# EAGLE design miniMother_v1 (EAGLE 9.6.2)
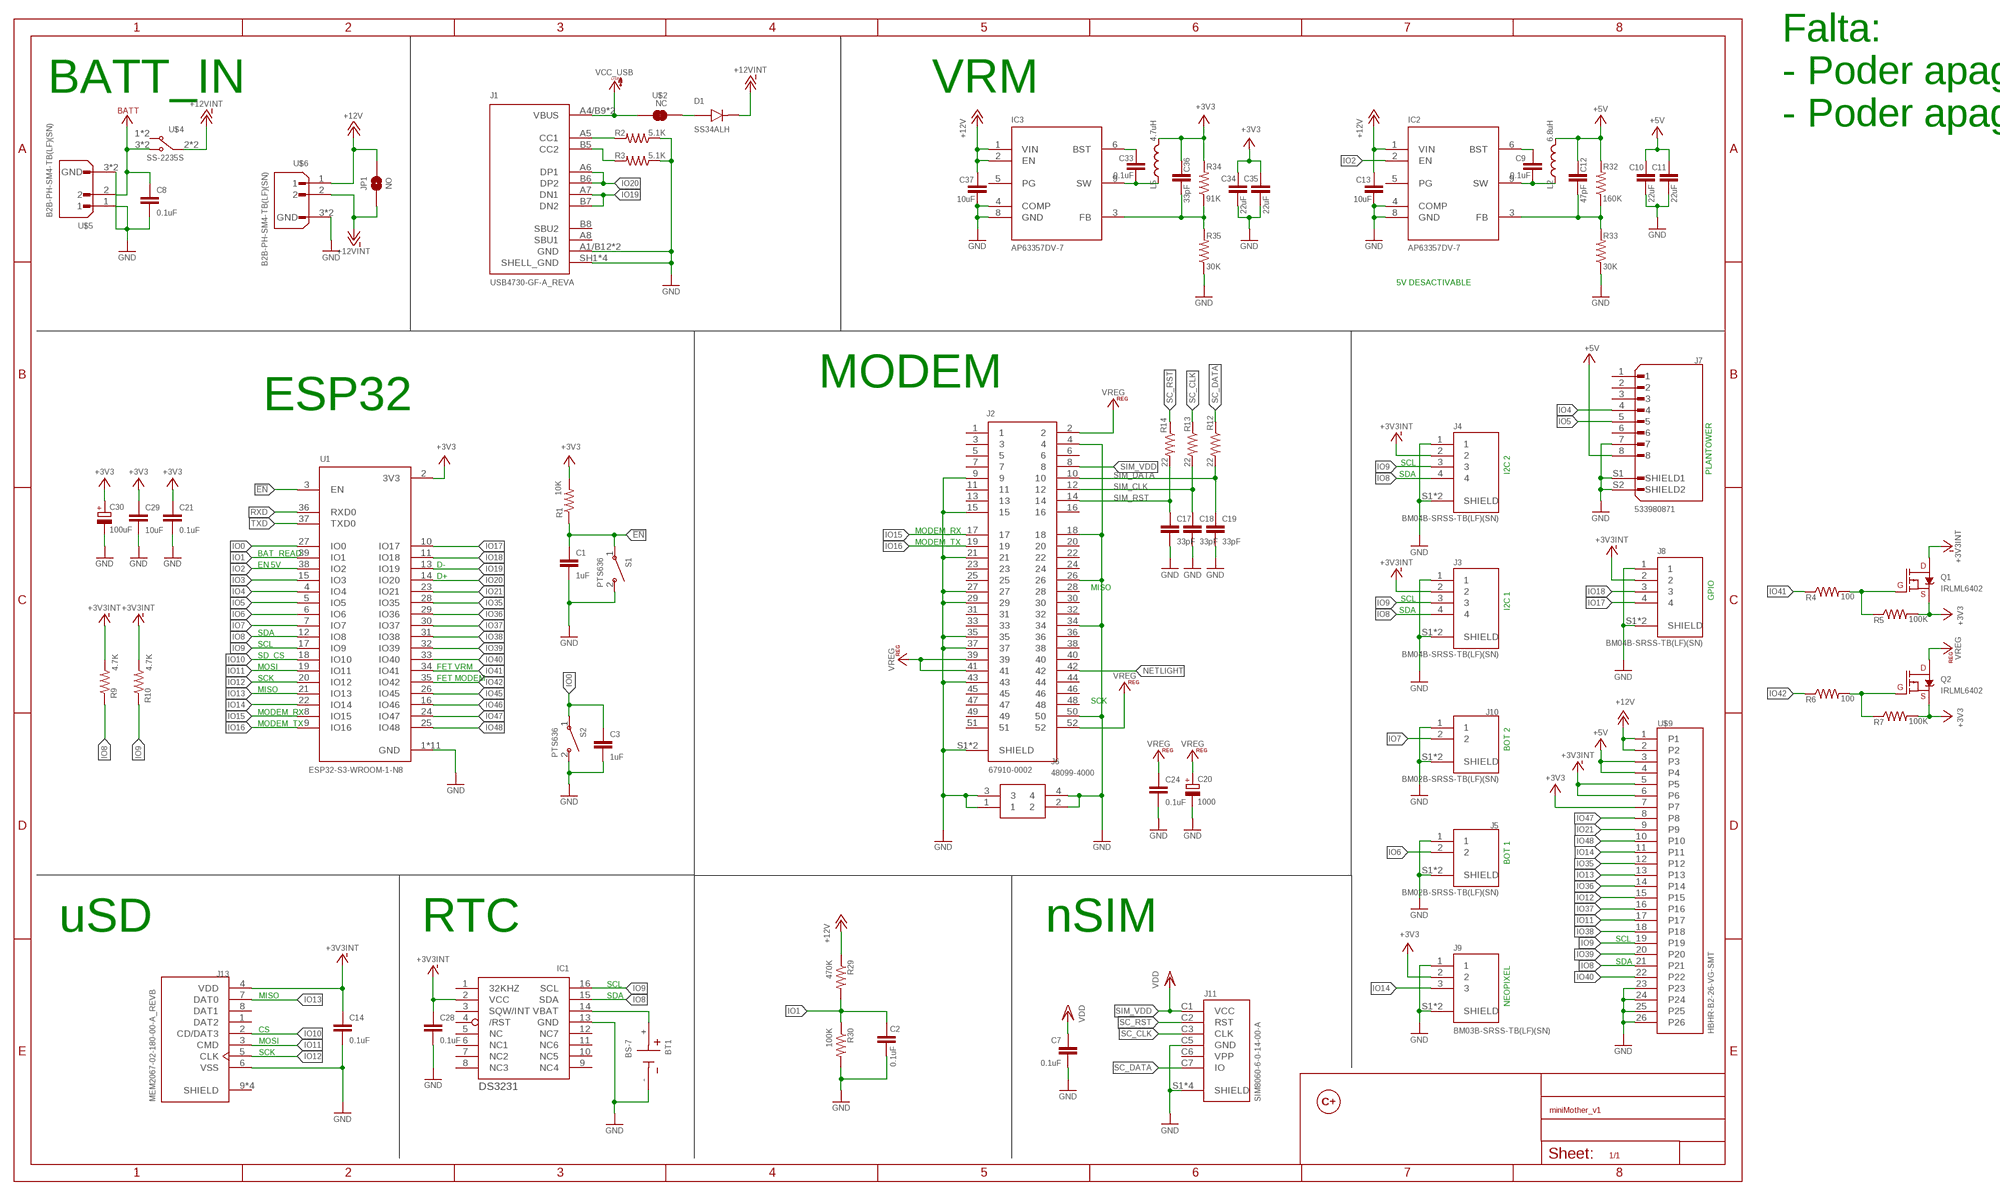
[diagram p0: schematic, sheet 1, part 1 of 2]
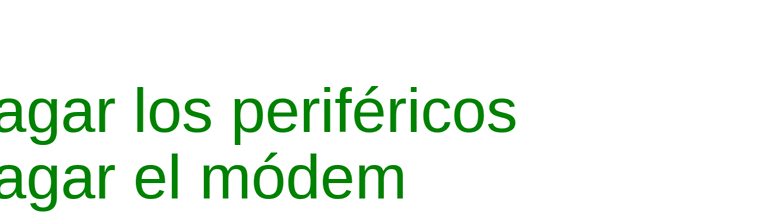
[diagram p1: schematic, sheet 1, part 2 of 2]

## Parts
BT1  BS-7  [BAT_BS-7]
C1  1uF  C-EUC0805  [C0805]
C2  0.1uF  C-EUC0805  [C0805]
C3  1uF  C-EUC0805  [C0805]
C7  0.1uF  C-EUC0805  [C0805]
C8  0.1uF  C-EUC0805  [C0805]
C9  0.1uF  C-EUC0805  [C0805]
C10  22uF  C-EUC0805  [C0805]
C11  22uF  C-EUC0805  [C0805]
C12  47pF  C-EUC0805  [C0805]
C13  10uF  C-EUC0805  [C0805]
C14  0.1uF  C-EUC0805  [C0805]
C17  33pF  C-EUC0805  [C0805]
C18  33pF  C-EUC0805  [C0805]
C19  33pF  C-EUC0805  [C0805]
C20  1000  CPOL-EUSMCD  [SMC_D]
C21  0.1uF  C-EUC0805  [C0805]
C24  0.1uF  C-EUC0805  [C0805]
C28  0.1uF  C-EUC0805  [C0805]
C29  10uF  C-EUC0805  [C0805]
C30  100uF  CPOL-EUCT3528  [CT3528]
C33  0.1uF  C-EUC0805  [C0805]
C34  22uF  C-EUC0805  [C0805]
C35  22uF  C-EUC0805  [C0805]
C36  33pF  C-EUC0805  [C0805]
C37  10uF  C-EUC0805  [C0805]
D1  SS34ALH  [SODFL5226X100N]
IC1  DS3231/SO  [SO16W]
IC2  AP63357DV-7  [AP63357DV7]
IC3  AP63357DV-7  [AP63357DV7]
J1  USB4730-GF-A_REVA  [GCT_USB4730-GF-A_REVA]
J2  67910-0002  [MOLEX_67910-0002]
J3  BM04B-SRSS-TB(LF)(SN)  [JST_BM04B-SRSS-TB(LF)(SN)]
J4  BM04B-SRSS-TB(LF)(SN)  [JST_BM04B-SRSS-TB(LF)(SN)]
J5  BM02B-SRSS-TB(LF)(SN)  [JST_BM02B-SRSS-TB(LF)(SN)]
J6  48099-4000  [480994000]
J7  533980871  [MOLEX_533980871]
J8  BM04B-SRSS-TB(LF)(SN)  [JST_BM04B-SRSS-TB(LF)(SN)]
J9  BM03B-SRSS-TB(LF)(SN)  [JST_BM03B-SRSS-TB(LF)(SN)]
J10  BM02B-SRSS-TB(LF)(SN)  [JST_BM02B-SRSS-TB(LF)(SN)]
J11  SIM8060-6-0-14-00-A  [GCT_SIM8060-6-0-14-00-A]
J13  MEM2067-02-180-00-A_REVB  [GCT_MEM2067-02-180-00-A_REVB]
JP1  NO  JUMPER-SMT_2_NO_NO-SILK_ROUND  [SMT-JUMPER_2_NO_NO-SILK_ROUND]
L2  6.8uH  MDH7045C-220MA=P3  [IND_MDH7045C-220MA=P3]
L5  4.7uH  MDH7045C-220MA=P3  [IND_MDH7045C-220MA=P3]
Q1  IRLML6402  MOSFET_PCH-SI2309DS  [SOT23-3]
Q2  IRLML6402  MOSFET_PCH-SI2309DS  [SOT23-3]
R1  10K  R-US_R0805  [R0805]
R2  5.1K  R-US_R0805  [R0805]
R3  5.1K  R-US_R0805  [R0805]
R4  100  R-US_R0805  [R0805]
R5  100K  R-US_R0805  [R0805]
R6  100  R-US_R0805  [R0805]
R7  100K  R-US_R0805  [R0805]
R9  4.7K  R-US_R0805  [R0805]
R10  4.7K  R-US_R0805  [R0805]
R12  22  R-US_R0805  [R0805]
R13  22  R-US_R0805  [R0805]
R14  22  R-US_R0805  [R0805]
R29  470K  R-US_R0805  [R0805]
R30  100K  R-US_R0805  [R0805]
R32  160K  R-US_R0805  [R0805]
R33  30K  R-US_R0805  [R0805]
R34  91K  R-US_R0805  [R0805]
R35  30K  R-US_R0805  [R0805]
S1  PTS636  PTS636_SM43J_SMTR_LFS  [SW_PTS636_SM43J_SMTR_LFS]
S2  PTS636  PTS636_SM43J_SMTR_LFS  [SW_PTS636_SM43J_SMTR_LFS]
U1  ESP32-S3-WROOM-1-N8  [XCVR_ESP32-S3-WROOM-1-N8]
U$1  LOGO_CMAS10MM  [LOGO_10MM]
U$2  NC  SMT-JUMPER-2_NC  [SMT-JUMPER-2_NC]
U$4  SS-2235S  [SS-2235S]
U$5  B2B-PH-SM4-TB(LF)(SN)  [JST_B2B-PH-SM4-TB(LF)(SN)]
U$6  B2B-PH-SM4-TB(LF)(SN)  [JST_B2B-PH-SM4-TB(LF)(SN)]
U$9  HBHR-B2-26-VG-SMT  [HBHR-B2-26-VG-SMT]

## Nets
!EN: C1.1 R1.1 S1.1(COM) U1.3(EN)
+3V3 [PWR]: C21.1 C29.1 C30.+ C34.1 C35.1 C36.1 J9.2 L5.2 Q1.2(S) Q2.2(S) R1.2 R5.2 R7.2 R34.2 U1.2(3V3) U$9.7
+3V3INT [PWR]: C14.1 C28.1 IC1.2(VCC) J3.2 J4.2 J8.2 J13.4(VDD) Q1.3(D) R9.2 R10.2 U$9.5 U$9.6
+5V [PWR]: C10.1 C11.1 C12.1 J7.8 L2.2 R32.2 U$9.3 U$9.4
+12V [PWR_IN]: C13.1 C37.1 IC2.1(VIN) IC3.1(VIN) IC3.2(EN) JP1.1 R29.1 U$6.1 U$9.1 U$9.2
+12VINT [PWR_IN]: D1.1(K) JP1.2 U$4.2(P1) U$4.5(P1) U$6.2
GND [PWR]: BT1.- C1.2 C2.2 C3.2 C7.2 C8.2 C10.2 C11.2 C13.2 C14.2 C17.2 C18.2 C19.2 C20.- C21.2 C24.2 C28.2 C29.2 C30.- C34.2 C35.2 C37.2 IC1.13(GND) IC2.4(COMP) IC2.8(GND) IC3.4(COMP) IC3.8(GND) J1.A1/B12(GND) J1.B1/A12(GND) J1.SH1(SHELL_GND) J1.SH2(SHELL_GND) J1.SH3(SHELL_GND) J1.SH4(SHELL_GND) J2.4 J2.9 J2.15 J2.18 J2.21 J2.26 J2.27 J2.29 J2.34 J2.35 J2.37 J2.43 J2.50 J2.S1(SHIELD) J2.S2(SHIELD) J3.1 J3.S1(SHIELD) J3.S2(SHIELD) J4.1 J4.S1(SHIELD) J4.S2(SHIELD) J5.1 J5.S1(SHIELD) J5.S2(SHIELD) J6.1 J6.2 J6.3 J6.4 J7.7 J7.S1(SHIELD1) J7.S2(SHIELD2) J8.1 J8.S1(SHIELD) J8.S2(SHIELD) J9.1 J9.S1(SHIELD) J9.S2(SHIELD) J10.1 J10.S1(SHIELD) J10.S2(SHIELD) J11.C5(GND) J11.S1(SHIELD) J11.S2(SHIELD) J11.S3(SHIELD) J11.S4(SHIELD) J13.6(VSS) R2.1 R3.1 R30.2 R33.1 R35.1 S1.2(NO) S2.2(NO) U1.1(GND) U1.40(GND) U1.41_1(GND) U1.41_2(GND) U1.41_3(GND) U1.41_4(GND) U1.41_5(GND) U1.41_6(GND) U1.41_7(GND) U1.41_8(GND) U1.41_9(GND) U$5.1 U$5.3(GND) U$5.4(GND) U$6.3(GND) U$6.4(GND) U$9.23 U$9.24 U$9.25 U$9.26
IO0: C3.1 S2.1(COM) U1.27(IO0)
IO1: C2.1 R29.2 R30.1 U1.39(IO1)
IO2: IC2.2(EN) U1.38(IO2)
IO3: U1.15(IO3)
IO4: J7.4 U1.4(IO4)
IO5: J7.5 U1.5(IO5)
IO6: J5.2 U1.6(IO6)
IO7: J10.2 U1.7(IO7)
IO8: IC1.15(SDA) J3.4 J4.4 R9.1 U1.12(IO8) U$9.21
IO9: IC1.16(SCL) J3.3 J4.3 R10.1 U1.17(IO9) U$9.19
IO10: J13.2(CD/DAT3) U1.18(IO10)
IO11: J13.3(CMD) U1.19(IO11) U$9.17
IO12: J13.5(CLK) U1.20(IO12) U$9.15
IO13: J13.7(DAT0) U1.21(IO13) U$9.13
IO14: J9.3 U1.22(IO14) U$9.11
IO15: J2.17 U1.8(IO15)
IO16: J2.19 U1.9(IO16)
IO17: J8.4 U1.10(IO17)
IO18: J8.3 U1.11(IO18)
IO19: J1.A7(DN1) J1.B7(DN2) U1.13(IO19)
IO20: J1.A6(DP1) J1.B6(DP2) U1.14(IO20)
IO21: U1.23(IO21) U$9.9
IO35: U1.28(IO35) U$9.12
IO36: U1.29(IO36) U$9.14
IO37: U1.30(IO37) U$9.16
IO38: U1.31(IO38) U$9.18
IO39: U1.32(IO39) U$9.20
IO40: U1.33(IO40) U$9.22
IO41: R4.1 U1.34(IO41)
IO42: R6.1 U1.35(IO42)
IO45: U1.26(IO45)
IO46: U1.16(IO46)
IO47: U1.24(IO47) U$9.8
IO48: U1.25(IO48) U$9.10
N$1: J1.A5(CC1) R2.2
N$2: BT1.+ IC1.14(VBAT)
N$3: D1.2(A) U$2.2
N$4: Q1.1(G) R4.2 R5.1
N$5: J1.B5(CC2) R3.2
N$7: Q2.1(G) R6.2 R7.1
N$10: C9.1 IC2.6(BST)
N$26: C9.2 IC2.9(SW) L2.1
N$31: C12.2 IC2.3(FB) R32.1 R33.2
N$33: C33.1 IC3.6(BST)
N$34: C33.2 IC3.9(SW) L5.1
N$35: C36.2 IC3.3(FB) R34.1 R35.2
NETLIGHT: J2.42
RXD: U1.36(RXD0)
SC_CLK: J11.C3(CLK) R13.1
SC_DATA: J11.C7(IO) R12.1
SC_RST: J11.C2(RST) R14.1
SIM_CLK: C18.1 J2.12 R13.2
SIM_DATA: C19.1 J2.10 R12.2
SIM_RST: C17.1 J2.14 R14.2
SIM_VDD: C7.1 J2.8 J11.C1(VCC) ; supply symbol labelled VDD
TXD: U1.37(TXD0)
VBAT [PWR_IN]: C8.1 U$4.3(T2) U$4.6(T2) U$5.2
VCC_USB [PWR]: J1.A4/B9(VBUS) J1.B4/A9(VBUS) U$2.1
VREG [PWR]: C20.+ C24.1 J2.2 J2.39 J2.41 J2.52 Q2.3(D)
Unconnected: IC1.1(32KHZ) IC1.3(SQW/INT) IC1.4(/RST) IC1.5(NC) IC1.6(NC1) IC1.7(NC2) IC1.8(NC3) IC1.9(NC4) IC1.10(NC5) IC1.11(NC6) IC1.12(NC7) IC2.5(PG) IC3.5(PG) J1.A8(SBU1) J1.B8(SBU2) J2.1 J2.3 J2.5 J2.6 J2.7 J2.11 J2.13 J2.16 J2.20 J2.22 J2.23 J2.24 J2.25 J2.28 J2.30 J2.31 J2.32 J2.33 J2.36 J2.38 J2.40 J2.44 J2.45 J2.46 J2.47 J2.48 J2.49 J2.51 J7.1 J7.2 J7.3 J7.6 J11.C6(VPP) J13.1(DAT2) J13.8(DAT1) J13.9(SHIELD) J13.10(SHIELD) J13.11(SHIELD) J13.12(SHIELD) U$4.1(T1) U$4.4(T1)

## Notes on the sheet
- BATT_IN | VRM
- Falta:
  - Poder apagar los periféricos
  - Poder apagar el módem
- 5V DESACTIVABLE
- MODEM
- ESP32
- I2C 2
- SCL
- SDA | PLANTOWER
- MODEM_RX
- MODEM_TX
- BAT_READ
- EN 5V | D-
- D+ | GPIO
- MISO | I2C 1
- SCL
- SDA
- SDA
- SCL
- SD_CS
- MOSI | FET VRM
- SCK | FET MODEM
- MISO
- SCK
- MODEM_RX
- MODEM_TX | BOT 2
- BOT 1
- uSD | RTC | nSIM
- SCL
- NEOPIXEL | SDA
- SCL
- MISO | SDA
- CS
- MOSI
- SCK

## Library data of the parts
BT1 = BS-7:BS-7: BATTERY HOLDER COIN 20MM PC PIN Check availability <https://pricing.snapeda.com/parts/BS-7/MPD%20%28Memory/view-part?ref=eda>; AVAILABILITY: In Stock; CHECK_PRICES: https://www.snapeda.com/parts/BS-7/MPD+%2528Memory+Protection+Devices%2529/view-part/?ref=eda; DESCRIPTION: Battery Holder (Open) Coin, 20.0mm 1 Cell PC Pin; MF: MPD (Memory; MP: BS-7; PACKAGE: None; PRICE: None; PURCHASE-URL: https://www.snapeda.com/api/url_track_click_mouser/?unipart_id=1156502&manufacturer=MPD (Memory&part_name=BS-7&search_term=coin cell 20mm; SNAPEDA_LINK: https://www.snapeda.com/parts/BS-7/MPD+%2528Memory+Protection+Devices%2529/view-part/?ref=snap
C1-C3 C7-C14 C17-C19 C21 C24 C28 C29 C33-C37 = rcl:C-EU: CAPACITOR, European symbol; SPICEPREFIX: C
C20 C30 = rcl:CPOL-EU: POLARIZED CAPACITOR, European symbol; SPICEPREFIX: C
D1 = SS34ALH:SS34ALH: Check availability <https://pricing.snapeda.com/parts/SS34ALH/Taiwan%20Semiconductor/view-part?ref=eda>; AVAILABILITY: In Stock; CHECK_PRICES: https://www.snapeda.com/parts/SS34ALH/Taiwan+Semiconductor/view-part/?ref=eda; DESCRIPTION: 3A, 40V, Schottky Rectifier; MF: Taiwan Semiconductor; MP: SS34ALH; PACKAGE: DO-221AC-2 Taiwan Semiconductor; PRICE: None; PURCHASE-URL: https://www.snapeda.com/api/url_track_click_mouser/?unipart_id=9409378&manufacturer=Taiwan Semiconductor&part_name=SS34ALH&search_term=ss34; SNAPEDA_LINK: https://www.snapeda.com/parts/SS34ALH/Taiwan+Semiconductor/view-part/?ref=snap
IC1 = DS3231:DS3231: Check availability <https://pricing.snapeda.com/parts/DS3231/Analog%20Devices/view-part?ref=eda>; AVAILABILITY: In Stock; CHECK_PRICES: https://www.snapeda.com/parts/DS3231/Analog+Devices/view-part/?ref=eda; DESCRIPTION: Real Time Clock (RTC) IC Clock/Calendar - I²C, 2-Wire Serial 8-SOIC (0.154, 3.90mm Width); MF: Analog Devices; MP: DS3231; PACKAGE: SOIC-16 Maxim Integrated; PRICE: None; SNAPEDA_LINK: https://www.snapeda.com/parts/DS3231/Analog+Devices/view-part/?ref=snap
IC2 IC3 = AP63357DV-7:AP63357DV-7: Switching Voltage Regulators DCDC Conv HV Buck V-DFN3020-13 T&R 3K Source: Datasheet <https://www.diodes.com//assets/Datasheets/AP63356-AP63357.pdf>; ARROW_PART_NUMBER: AP63357DV-7; ARROW_PRICE-STOCK: https://www.arrow.com/en/products/ap63357dv-7/diodes-incorporated?utm_currency=USD&region=europe; DESCRIPTION: Switching Voltage Regulators DCDC Conv HV Buck V-DFN3020-13 T&R 3K; HEIGHT: 0.85mm; MANUFACTURER_NAME: Diodes Incorporated; MANUFACTURER_PART_NUMBER: AP63357DV-7; MOUSER_PART_NUMBER: 621-AP63357DV-7; MOUSER_PRICE-STOCK: https://www.mouser.co.uk/ProductDetail/Diodes-Incorporated/AP63357DV-7?qs=bZr6mbWTK5nW8IurdDD0lw%3D%3D
J1 = con-usb:USB4730-GF-A_REVA: Check availability <https://pricing.snapeda.com/parts/USB4730-GF-A/Global%20Connector%20Technology/view-part?ref=eda>; AVAILABILITY: In Stock; CHECK_PRICES: https://www.snapeda.com/parts/USB4730-GF-A/Global+Connector+Technology/view-part/?ref=eda; DESCRIPTION: USB-C (USB TYPE-C) USB 2.0 Receptacle Connector 24 (16+8 Dummy) Position Surface Mount, Right Angle; Through Hole; LCSC: C5446865; MF: Global Connector Technology; MP: USB4730-GF-A; PACKAGE: None; PRICE: None; SNAPEDA_LINK: https://www.snapeda.com/parts/USB4730-GF-A/Global+Connector+Technology/view-part/?ref=snap
J2 = 67910-0002:67910-0002: 52 Position Female Connector PCI Express Mini Card Gold 0.031" (0.80mm) Black Check prices <https://pricing.snapeda.com/parts/67910-0002/Molex/view-part?ref=eda>; AVAILABILITY: In Stock; DESCRIPTION: 52 Position Female Connector PCI Express Mini Card Gold 0.031 (0.80mm) Black; MF: Molex; MP: 67910-0002; PACKAGE: None; PRICE: None
J3 J4 J8 = con-jst_sh:BM04B-SRSS-TB(LF)(SN): Check availability <https://pricing.snapeda.com/parts/BM04B-SRSS-TB%28LF%29%28SN%29/JST%20Sales/view-part?ref=eda>; AVAILABILITY: In Stock; CHECK_PRICES: https://www.snapeda.com/parts/BM04B-SRSS-TB(LF)(SN)/JST/view-part/?ref=eda; DESCRIPTION: Connector Header Surface Mount 4 position 0.039 (1.00mm); MF: JST Sales; MP: BM04B-SRSS-TB(LF)(SN); PACKAGE: None; PRICE: None; SNAPEDA_LINK: https://www.snapeda.com/parts/BM04B-SRSS-TB(LF)(SN)/JST/view-part/?ref=snap
J5 J10 = con-jst_sh:BM02B-SRSS-TB(LF)(SN): Check availability <https://pricing.snapeda.com/parts/BM02B-SRSS-TB%20%28LF%29%28SN%29/JST%20Corporation/view-part?ref=eda>; AVAILABILITY: In Stock; CHECK_PRICES: https://www.snapeda.com/parts/BM02B-SRSS-TB%20(LF)(SN)/JST/view-part/?ref=eda; DESCRIPTION: Connector Header Surface Mount 2 position 0.039 (1.00mm); MF: JST Corporation; MP: BM02B-SRSS-TB (LF)(SN); PACKAGE: None; PRICE: None; SNAPEDA_LINK: https://www.snapeda.com/parts/BM02B-SRSS-TB%20(LF)(SN)/JST/view-part/?ref=snap
J6 = mPCIe:48099-4000: Molex 48099 Series, Card Holder for use with Mini PCIe, PCI Source: Datasheet <https://media.digikey.com/pdf/Data Sheets/Molex PDFs/480994000_Dwg.pdf>; DESCRIPTION: Molex 48099 Series, Card Holder for use with Mini PCIe, PCI; HEIGHT: 4.8mm; MANUFACTURER_NAME: Molex; MANUFACTURER_PART_NUMBER: 48099-4000; MOUSER_PART_NUMBER: 538-48099-4000; MOUSER_PRICE-STOCK: https://www.mouser.co.uk/ProductDetail/Molex/48099-4000?qs=dsreSLQWyj8b%2FXEoksc%2Fog%3D%3D
J7 = 533980871:533980871: Check availability <https://pricing.snapeda.com/parts/53398-0871/Molex/view-part?ref=eda>; AVAILABILITY: In Stock; CHECK_PRICES: https://www.snapeda.com/parts/53398-0871/Molex/view-part/?ref=eda; DESCRIPTION: Conn; Rect; Header; 1.25 mm Pitch; PCB; 8 Cir; Ver; SMT; PicoBlade; LF | Molex Incorporated 53398-0871; MF: Molex; MP: 53398-0871; PACKAGE: None; PRICE: None; SNAPEDA_LINK: https://www.snapeda.com/parts/53398-0871/Molex/view-part/?ref=snap
J9 = BM03B-SRSS-TB_LF__SN_:BM03B-SRSS-TB(LF)(SN): Check availability <https://pricing.snapeda.com/parts/BM03B-SRSS-TB%28LF%29%28SN%29/JST%20Sales%20America%20Inc./view-part?ref=eda>; AVAILABILITY: In Stock; CHECK_PRICES: https://www.snapeda.com/parts/BM03B-SRSS-TB(LF)(SN)/JST/view-part/?ref=eda; DESCRIPTION: Connector Header Surface Mount 3 position 0.039 (1.00mm); MF: JST Sales America Inc.; MP: BM03B-SRSS-TB(LF)(SN); PACKAGE: None; PRICE: None; SNAPEDA_LINK: https://www.snapeda.com/parts/BM03B-SRSS-TB(LF)(SN)/JST/view-part/?ref=snap
J11 = simCardHolder:SIM8060-6-0-14-00-A: SIM8060 is a hinged Sim Card Connector. With 6 contacts, with switch for card detection. Profile above PCB is 1.43mm. Check availability <https://pricing.snapeda.com/parts/SIM8060-6-0-14-00-A/Global%20Connector%20Technology/view-part?ref=eda>; AVAILABILITY: In Stock; CHECK_PRICES: https://www.snapeda.com/parts/SIM8060-6-0-14-00-A/Global+Connector+Technology/view-part/?ref=eda; DESCRIPTION: 6 Position Card Connector NANO SIM Surface Mount, Right Angle Gold; MF: Global Connector Technology; MP: SIM8060-6-0-14-00-A; PACKAGE: None; PRICE: None; SNAPEDA_LINK: https://www.snapeda.com/parts/SIM8060-6-0-14-00-A/Global+Connector+Technology/view-part/?ref=snap
J13 = microsd:MEM2067-02-180-00-A_REVB: Check availability <https://pricing.snapeda.com/parts/MEM2067-02-180-00-A/Global%20Connector%20Technology/view-part?ref=eda>; AVAILABILITY: In Stock; CHECK_PRICES: https://www.snapeda.com/parts/MEM2067-02-180-00-A/Global+Connector+Technology/view-part/?ref=eda; DESCRIPTION: 8 Position Card Connector microSD Surface Mount, Right Angle Gold; MF: Global Connector Technology; MP: MEM2067-02-180-00-A; PACKAGE: None; PRICE: None; SNAPEDA_LINK: https://www.snapeda.com/parts/MEM2067-02-180-00-A/Global+Connector+Technology/view-part/?ref=snap
JP1 = SparkFun-Jumpers:JUMPER-SMT_2_NO: Normally open jumper This jumper has two pads in close proximity to each other. Apply solder to close the connection. Round pads are easier to solder for beginners, but are a lot larger. SparkFun Product that uses the round pads: SparkFun EL Sequencer <https://www.sparkfun.com/products/12781>
L2 L5 = MDH7045C-220MA_P3:MDH7045C-220MA=P3: Inductor Power Shielded Wirewound 100uH 20% 100KHz Ferrite 0.8A 0.377Ohm DCR 2928 Automotive T/R Check availability <https://pricing.snapeda.com/parts/MDH7045C-220MA%3DP3/Murata/view-part?ref=eda>; AVAILABILITY: In Stock; CHECK_PRICES: https://www.snapeda.com/parts/MDH7045C-220MA=P3/Murata/view-part/?ref=eda; DESCRIPTION: Inductor with Inductance: 22uH Tol. +/-20%, Package: 2928 (7470); MF: Murata; MP: MDH7045C-220MA=P3; PACKAGE: NONSTANDARD; PRICE: None; SNAPEDA_LINK: https://www.snapeda.com/parts/MDH7045C-220MA=P3/Murata/view-part/?ref=snap
Q1 Q2 = transistor:MOSFET_PCH: P-channel MOSFETs Voltage controlled devices that allow control of high current outputs. SparkFun Products: SparkFun ESP32 Thing <https://www.sparkfun.com/products/13907> SparkFun ESP8266 Thing <https://www.sparkfun.com/products/13231> SparkFun Pi Servo HAT V2 <https://www.sparkfun.com/products/15316> DMG2305UX-7 (20V/4.2A/SOT23-3); PROD_ID: TRANS-08285; VALUE: 1.1A/60V/600mΩ
R1-R7 R9 R10 R12-R14 R29 R30 R32-R35 = rcl:R-US_: RESISTOR, American symbol; SPICEPREFIX: R
S1 S2 = switch-momentary:PTS636_SM43J_SMTR_LFS: Tactile Switch SPST-NO Top Actuated Surface Mount Check availability <https://pricing.snapeda.com/parts/PTS636%20SM43J%20SMTR%20LFS/C%26K/view-part?ref=eda>; AVAILABILITY: In Stock; CHECK_PRICES: https://www.snapeda.com/parts/PTS636%20SM43J%20SMTR%20LFS/C%2526K/view-part/?ref=eda; DESCRIPTION: Tactile Switch SPST-NO Top Actuated Surface Mount; MF: C&K; MP: PTS636 SM43J SMTR LFS; PACKAGE: None; PRICE: None; SNAPEDA_LINK: https://www.snapeda.com/parts/PTS636%20SM43J%20SMTR%20LFS/C%2526K/view-part/?ref=snap
U1 = ESP32-S3-WROOM-1-N8:ESP32-S3-WROOM-1-N8: Check availability <https://pricing.snapeda.com/parts/ESP32-S3-WROOM-1-N8/Espressif%20Systems/view-part?ref=eda>; AVAILABILITY: In Stock; CHECK_PRICES: https://www.snapeda.com/parts/ESP32-S3-WROOM-1-N8/Espressif+Systems/view-part/?ref=eda; DESCRIPTION: WiFi 802.11a/b/g/n, Bluetooth v5.0 Transceiver Module 2.4GHz Antenna Not Included -; MF: Espressif Systems; MP: ESP32-S3-WROOM-1-N8; PACKAGE: NON STANDARD Espressif Systems; PRICE: None; SNAPEDA_LINK: https://www.snapeda.com/parts/ESP32-S3-WROOM-1-N8/Espressif+Systems/view-part/?ref=snap
U$1 = logoCmas:LOGO_CMAS
U$2 = solderpad:SMT-JUMPER-2_NC
U$4 = switch_slide:SS-2235S
U$5 U$6 = con-jst_ph:B2B-PH-SM4-TB(LF)(SN): Japan solderless terminals. 2mm pitch, 2 pins. Check availability <https://pricing.snapeda.com/parts/B2B-PH-SM4-TB%28LF%29%28SN%29/JST%20Sales/view-part?ref=eda>; AVAILABILITY: In Stock; CHECK_PRICES: https://www.snapeda.com/parts/B2B-PH-SM4-TB(LF)(SN)/JST+Sales+America+Inc./view-part/?ref=eda; DESCRIPTION: Connector Header Surface Mount 2 position 0.079 (2.00mm); MF: JST Sales; MP: B2B-PH-SM4-TB(LF)(SN); PACKAGE: NON STANDARD-2 JST; PRICE: None; SNAPEDA_LINK: https://www.snapeda.com/parts/B2B-PH-SM4-TB(LF)(SN)/JST+Sales+America+Inc./view-part/?ref=snap
U$9 = con-idc-1-27:HBHR-B2-26-VG-SMT: C42462830

## Net classes
0 default: width 0.254 mm
1 PWR: width 0.61 mm
2 PWR_IN: width 1.016 mm

## Board
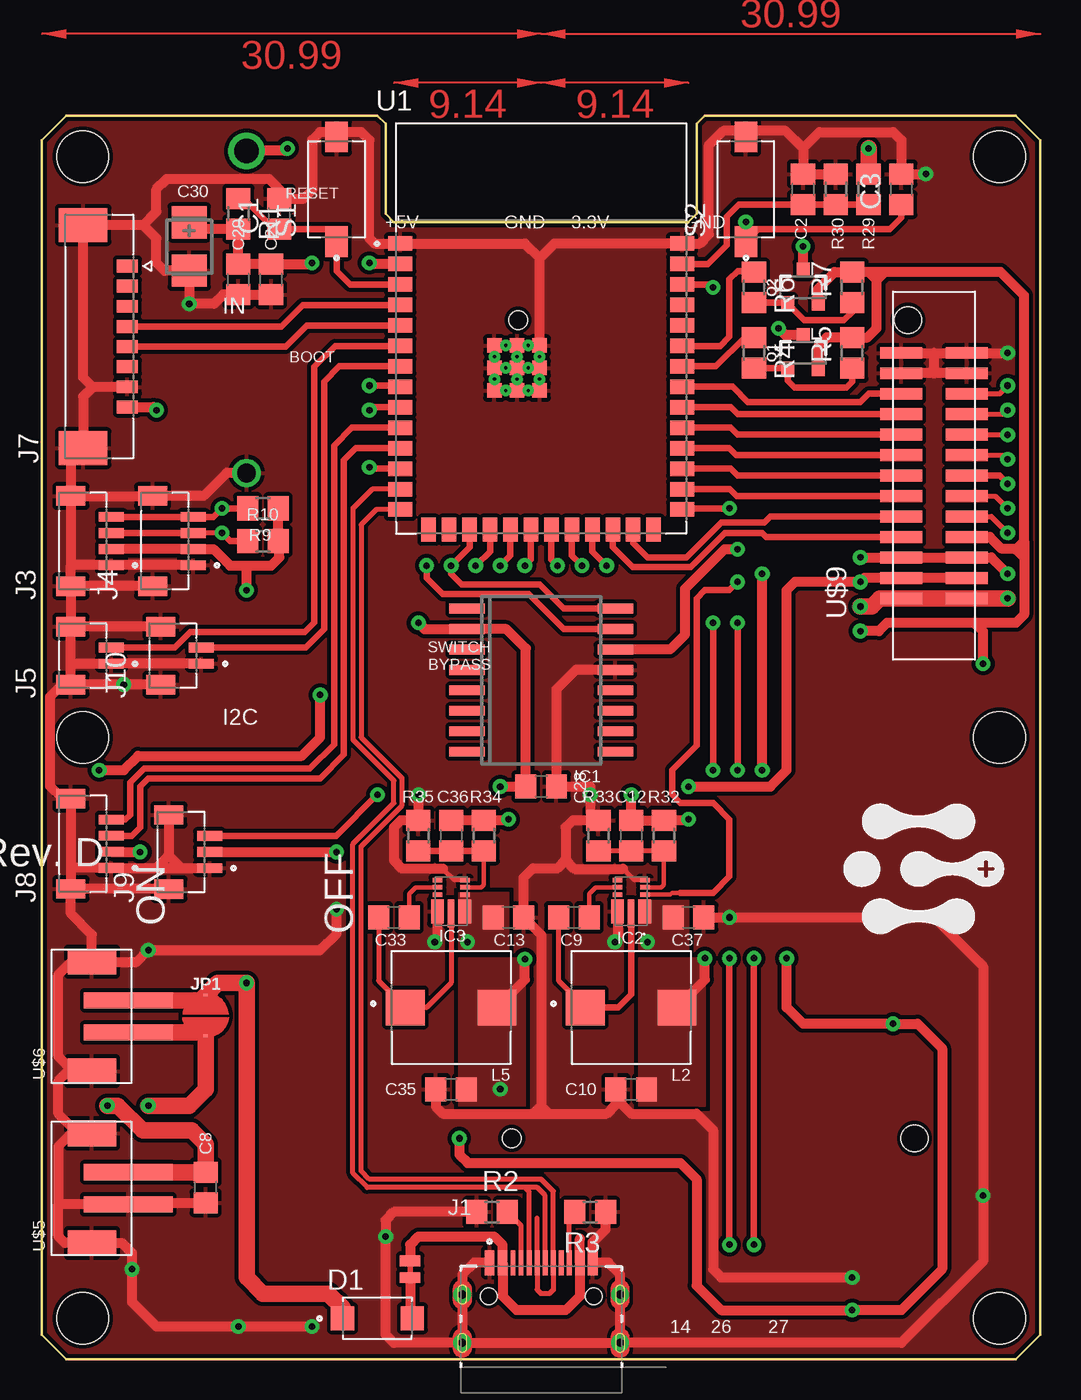
[diagram p2: board, top side]
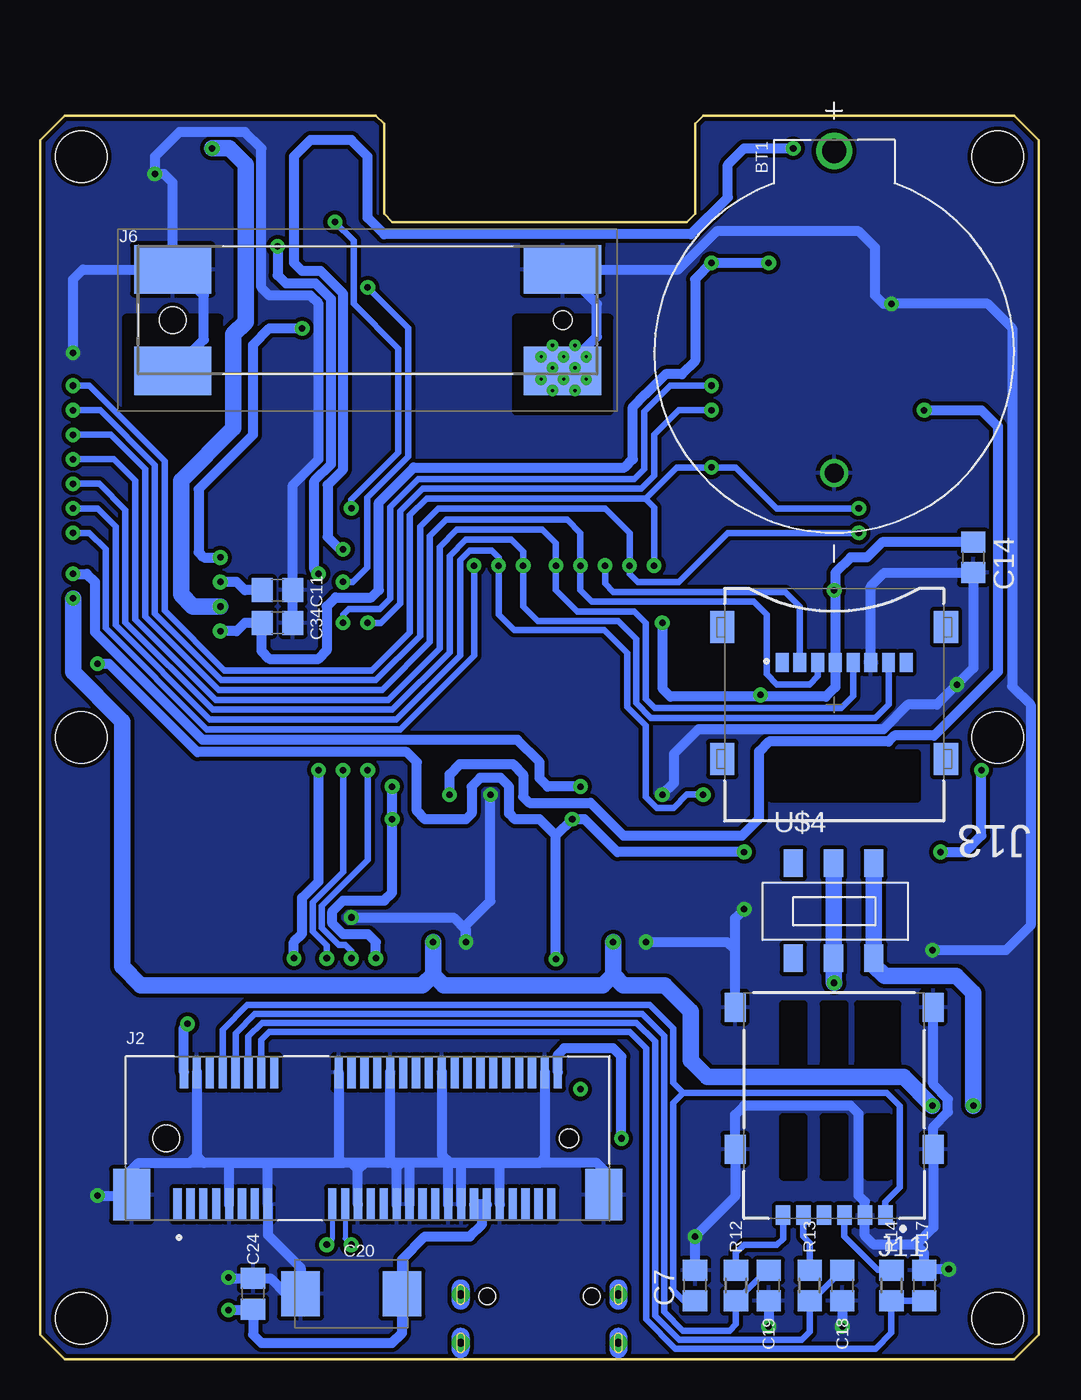
[diagram p3: board, bottom side, seen from below]

Size 61.98 x 77.22 mm. Coordinates in mm from the lower left corner, seen from the top.
Outline: 60.45,77.22 41.15,77.22 40.64,76.71 40.64,71.12 40.13,70.61 21.84,70.61 21.34,71.12 21.34,76.71 20.83,77.22 1.52,77.22 0,75.69 0,1.52 1.52,0 60.45,0 61.98,1.52 61.98,75.69 60.45,77.22
Copper layers (1*16): Top 0.035mm / dielectric 1.5mm / Bottom 0.035mm
Design rules "OthermillDRC_30_deg_v2 *": minimum track width 6mil, minimum drill 16mil, track to track 6mil, track to pad 6mil, pad to pad 6mil, via to via 6mil, smd to smd 0mil, copper to edge 0.000025mm, drill to drill 6mil, minimum pad ring 10mil, minimum via ring 10mil, stop-mask expansion 1mil, vias tented up to drill 30mil, thermal gap 10mil
Holes 3.2 mm at 2.54,2.54 2.54,74.68 59.44,74.68 59.44,2.54 59.44,38.61 2.54,38.61

### Footprints (pad centres in the part's own frame; a part is rotated, then mirrored left to right if it is on the bottom)
BAT_BS-7 = drill 1.5: + 10,0 | drill 1.17: - -10,0
C0805 = smd 1.3 x 1.5: 1 -0.95,0; 2 0.95,0
SMC_D = smd 2.4 x 2.8: + -3.15,0; - 3.15,0
CT3528 = smd 2 x 2.2: + -1.5,0; - 1.5,0
SODFL5226X100N = smd 1.44 x 1.48: 1 -2.165,0; 2 2.165,0
SO16W = smd 0.6 x 2.2: 1 -4.445,-4.6; 2 -3.175,-4.6; 3 -1.905,-4.6; 4 -0.635,-4.6; 5 0.635,-4.6; 6 1.905,-4.6; 7 3.175,-4.6; 8 4.445,-4.6; 9 4.445,4.6; 10 3.175,4.6; 11 1.905,4.6; 12 0.635,4.6; 13 -0.635,4.6; 14 -1.905,4.6; 15 -3.175,4.6; 16 -4.445,4.6
AP63357DV7 = smd 1.5 x 0.8: 1 -0.65,-0.85; 8 -0.65,0.85 | smd 0.279 x 0.6: 2 0.4,-0.85; 3 0.85,-0.85; 4 1.3,-0.85; 5 1.3,0.85; 6 0.85,0.85; 7 0.4,0.85 | smd 1.73 x 0.4: 9 -0.765,0
GCT_USB4730-GF-A_REVA = smd 0.6 x 1.55: A1/B12 -3.2,4.975; A4/B9 -2.4,4.975; B1/A12 3.2,4.975; B4/A9 2.4,4.975 | smd 0.3 x 1.55: A5 -1.25,4.975; A6 -0.25,4.975; A7 0.25,4.975; A8 1.25,4.975; B5 1.75,4.975; B6 0.75,4.975; B7 -0.75,4.975; B8 -1.75,4.975 | drill 0.5 pad 1.1: SH1 -4.895,0; SH2 4.895,0; SH3 -4.895,3; SH4 4.895,3 | hole 1.02: -3.25,2.9; 3.25,2.9
MOLEX_67910-0002 = smd 0.508 x 2: 1 -11.8,-4.1; 2 -11.4,4.1; 3 -11,-4.1; 4 -10.6,4.1; 5 -10.2,-4.1; 6 -9.8,4.1; 7 -9.4,-4.1; 8 -9,4.1; 9 -8.6,-4.1; 10 -8.2,4.1; 11 -7.8,-4.1; 12 -7.4,4.1; 13 -7,-4.1; 14 -6.6,4.1; 15 -6.2,-4.1; 16 -5.8,4.1; 17 -2.2,-4.1; 18 -1.8,4.1; 19 -1.4,-4.1; 20 -1,4.1; 21 -0.6,-4.1; 22 -0.2,4.1; 23 0.2,-4.1; 24 0.6,4.1; 25 1,-4.1; 26 1.4,4.1; 27 1.8,-4.1; 28 2.2,4.1; 29 2.6,-4.1; 30 3,4.1; 31 3.4,-4.1; 32 3.8,4.1; 33 4.2,-4.1; 34 4.6,4.1; 35 5,-4.1; 36 5.4,4.1; 37 5.8,-4.1; 38 6.2,4.1; 39 6.6,-4.1; 40 7,4.1; 41 7.4,-4.1; 42 7.8,4.1; 43 8.2,-4.1; 44 8.6,4.1; 45 9,-4.1; 46 9.4,4.1; 47 9.8,-4.1; 48 10.2,4.1; 49 10.6,-4.1; 50 11,4.1; 51 11.4,-4.1; 52 11.8,4.1 | smd 2.3 x 3.2: S1 -14.65,-3.5; S2 14.65,-3.5 | hole 1.65: -12.5,0 | hole 1.15: 12.5,0
JST_BM04B-SRSS-TB(LF)(SN) = smd 0.6 x 1.55: 1 -1.5,-1.775; 2 -0.5,-1.775; 3 0.5,-1.775; 4 1.5,-1.775 | smd 1.2 x 1.8: S1 -2.8,0.75; S2 2.8,0.75
JST_BM02B-SRSS-TB(LF)(SN) = smd 0.6 x 1.55: 1 -0.5,-1.775; 2 0.5,-1.775 | smd 1.2 x 1.8: S1 -1.8,0.75; S2 1.8,0.75
480994000 = smd 4.8 x 3: 1 -12.1,-3.15; 2 12.1,-3.15; 3 -12.1,3.15; 4 12.1,3.15 | hole 1.65: -12.1,0 | hole 1.15: 12.1,0
MOLEX_533980871 = smd 0.8 x 1.3: 1 4.375,-1.75; 2 3.125,-1.75; 3 1.875,-1.75; 4 0.625,-1.75; 5 -0.625,-1.75; 6 -1.875,-1.75; 7 -3.125,-1.75; 8 -4.375,-1.75 | smd 2.1 x 3: S1 -6.925,1; S2 6.925,1
JST_BM03B-SRSS-TB(LF)(SN) = smd 0.6 x 1.55: 1 -1,-1.775; 2 0,-1.775; 3 1,-1.775 | smd 1.2 x 1.8: S1 -2.3,0.75; S2 2.3,0.75
GCT_SIM8060-6-0-14-00-A = smd 0.9 x 1.2: C1 -3.175,6.8; C2 -0.635,6.8; C3 1.905,6.8; C5 -1.905,6.8; C6 0.635,6.8; C7 3.175,6.8 | smd 1.3 x 1.8: S1 -6.15,2.7; S2 6.15,2.7; S3 6.15,-6.1; S4 -6.15,-6.1
GCT_MEM2067-02-180-00-A_REVB = smd 0.8 x 1.2: 1 3.225,-2.625; 2 2.125,-2.625; 3 1.025,-2.625; 4 -0.075,-2.625; 5 -1.175,-2.625; 6 -2.275,-2.625; 7 -3.375,-2.625; 8 -4.475,-2.625 | smd 1.5 x 2: 9 -6.945,-4.825; 10 -6.945,3.375; 11 6.945,3.375; 12 6.945,-4.825
SMT-JUMPER_2_NO_NO-SILK_ROUND = smd 0.152 x 0.305: 1 -1.27,0; 2 1.27,0
IND_MDH7045C-220MA=P3 = smd 2.4 x 2.2: 1 -2.85,0; 2 2.85,0
SOT23-3 = smd 0.8 x 0.9: 1 -0.95,-1; 2 0.95,-1; 3 0,1.1
R0805 = smd 1.3 x 1.5: 1 -0.95,0; 2 0.95,0
SW_PTS636_SM43J_SMTR_LFS = smd 1.905 x 1.4: 1 -3.25,0; 2 3.25,0
XCVR_ESP32-S3-WROOM-1-N8 = smd 1.5 x 0.9: 1 -8.75,5.26; 2 -8.75,3.99; 3 -8.75,2.72; 4 -8.75,1.45; 5 -8.75,0.18; 6 -8.75,-1.09; 7 -8.75,-2.36; 8 -8.75,-3.63; 9 -8.75,-4.9; 10 -8.75,-6.17; 11 -8.75,-7.44; 12 -8.75,-8.71; 13 -8.75,-9.98; 14 -8.75,-11.25; 27 8.75,-11.25; 28 8.75,-9.98; 29 8.75,-8.71; 30 8.75,-7.44; 31 8.75,-6.17; 32 8.75,-4.9; 33 8.75,-3.63; 34 8.75,-2.36; 35 8.75,-1.09; 36 8.75,0.18; 37 8.75,1.45; 38 8.75,2.72; 39 8.75,3.99; 40 8.75,5.26 | smd 0.9 x 1.5: 15 -6.985,-12.5; 16 -5.715,-12.5; 17 -4.445,-12.5; 18 -3.175,-12.5; 19 -1.905,-12.5; 20 -0.635,-12.5; 21 0.635,-12.5; 22 1.905,-12.5; 23 3.175,-12.5; 24 4.445,-12.5; 25 5.715,-12.5; 26 6.985,-12.5 | smd 0.9 x 0.9: 41_1 -1.5,-2.46; 41_2 -2.9,-2.46; 41_3 -0.1,-2.46; 41_4 -2.9,-3.86; 41_5 -1.5,-3.86; 41_6 -0.1,-3.86; 41_7 -2.9,-1.06; 41_8 -1.5,-1.06; 41_9 -0.1,-1.06 | drill 0.2 pad 0.4: 41_10 -1.5,-1.76; 41_11 -2.9,-1.76; 41_12 -0.1,-1.76; 41_13 -2.9,-3.16; 41_14 -1.5,-3.16; 41_15 -0.1,-3.16; 41_16 -2.2,-1.06; 41_17 -0.8,-1.06; 41_18 -2.2,-2.46; 41_19 -0.8,-2.46; 41_20 -2.2,-3.86; 41_21 -0.8,-3.86
SMT-JUMPER-2_NC = smd 0.66 x 1.27: 1 -0.521,0; 2 0.521,0
SS-2235S = smd 1.2 x 1.7: 1 -2.54,3.36; 2 -0.04,3.36; 3 2.46,3.36; 4 -2.54,-2.54; 5 -0.04,-2.54; 6 2.46,-2.54
JST_B2B-PH-SM4-TB(LF)(SN) = smd 1 x 5.5: 1 -1.05,-1.8; 2 0.95,-1.8 | smd 1.6 x 3: 3 -3.45,0.45; 4 3.35,0.45
HBHR-B2-26-VG-SMT = smd 0.737 x 2.591: 1 -7.62,-2.54; 2 -7.62,1.524; 3 -6.35,-2.54; 4 -6.35,1.524; 5 -5.08,-2.54; 6 -5.08,1.524; 7 -3.81,-2.54; 8 -3.81,1.524; 9 -2.54,-2.54; 10 -2.54,1.524; 11 -1.27,-2.54; 12 -1.27,1.524; 13 0,-2.54; 14 0,1.524; 15 1.27,-2.54; 16 1.27,1.524; 17 2.54,-2.54; 18 2.54,1.524; 19 3.81,-2.54; 20 3.81,1.524; 21 5.08,-2.54; 22 5.08,1.524; 23 6.35,-2.54; 24 6.35,1.524; 25 7.62,-2.54; 26 7.62,1.524

### Placement (x,y rotation side)
BT1  12.7,65.02 90 bottom
C1  14.73,71.12 90 top
C2  47.24,72.64 90 top
C3  53.34,72.64 90 top
C7  21.34,4.57 90 bottom
C8  10.16,10.67 270 top
C9  33.02,27.43 180 top
C10  36.58,16.76 180 top
C11  47.24,47.75 0 bottom
C12  36.58,32.51 270 top
C13  28.96,27.43 0 top
C14  4.06,49.78 270 bottom
C17  7.11,4.57 90 bottom
C18  12.19,4.57 270 bottom
C19  16.76,4.57 270 bottom
C20  42.67,4.06 180 bottom
C21  14.22,67.06 270 top
C24  48.77,4.06 90 bottom
C28  30.99,35.56 0 top
C29  12.19,67.06 270 top
C30  9.14,69.09 270 top
C33  21.84,27.43 180 top
C34  47.24,45.72 0 bottom
C35  25.4,16.76 180 top
C36  25.4,32.51 270 top
C37  40.13,27.43 0 top
D1  20.83,2.54 0 top
IC1  30.99,42.16 270 top
IC2  36.58,28.45 90 top
IC3  25.4,28.45 90 top
J1  30.99,1.02 0 top
J2  41.66,13.72 0 bottom
J3  2.54,50.8 90 top
J4  7.62,50.8 90 top
J5  2.54,43.69 90 top
J6  41.66,64.52 0 bottom
J7  3.56,63.5 90 top
J8  2.54,32 90 top
J9  8.64,31.5 90 top
J10  8.13,43.69 90 top
J11  12.7,15.75 180 bottom
J13  12.7,40.64 180 bottom
JP1  10.16,21.34 90 top
L2  36.58,21.84 0 top
L5  25.4,21.84 0 top
Q1  47.24,62.48 0 top
Q2  47.24,66.55 0 top
R1  12.19,71.12 270 top
R2  27.94,9.14 0 top
R3  34.04,9.14 180 top
R4  44.2,62.48 270 top
R5  50.29,62.48 90 top
R6  44.2,66.55 270 top
R7  50.29,66.55 90 top
R9  13.72,52.83 0 top
R10  13.72,50.8 0 top
R12  18.8,4.57 270 bottom
R13  14.22,4.57 270 bottom
R14  9.14,4.57 270 bottom
R29  51.31,72.64 270 top
R30  49.28,72.64 90 top
R32  38.61,32.51 90 top
R33  34.54,32.51 270 top
R34  27.43,32.51 90 top
R35  23.37,32.51 270 top
S1  18.29,72.64 90 top
S2  43.69,72.64 90 top
U1  30.99,64.01 0 top
U$1  54.36,30.48 0 top
U$2  22.86,5.59 270 top
U$4  12.7,27.43 0 bottom
U$5  3.56,10.67 90 top
U$6  3.56,21.34 90 top
U$9  54.86,54.86 90 top

### Tracks (layer width: path | path; a pad name or v marks a point on that pad's centre or on a via)
!EN
  Top 0.305: 18.29,69.6 S1.1
  Top 0.406: U1.3 19.12,66.73 18.29,67.56 S1.1 | 18.29,69.6 17.71,70.17 C1.1 14.42,70.17 12.52,72.07 R1.1
+3V3  (via drill 0.41)
  Top 0.61: U1.2 20.39,68 v20.32,68.07 | Q2.2 48.19,66.48 49.21,67.5 R7.2 51.31,67.5 | Q1.2 48.19,62.93 48.7,63.43 R5.2 51.24,63.43 51.82,64.01 51.82,66.99 | C30.+ 9.56,70.17 R1.2 C29.1 C21.1 16.7,68.01 v16.76,68.07 | v50.8,45.21 51.94,45.21 52.45,45.72 57.91,45.72 | 57.91,45.72 60.45,45.72 60.96,46.23 60.96,49.78 | 52.32,67.5 59.5,67.5 60.96,66.04 60.96,50.8 | 52.32,67.5 51.31,67.5 | 51.82,66.99 51.31,67.5 | 51.82,66.99 52.32,67.5 | C36.1 R34.2 28.89,33.46 v28.96,33.53 | 60.96,50.8 60.96,49.78 | 60.5,50.34 60.96,50.8 | U$9.7 58.83,51.05 59.54,50.34 60.5,50.34 | 60.96,49.78 60.5,50.24 60.5,50.34 | L5.2 29.97,23.57 v29.97,24.84 | J9.2 v18.29,31.5 | 57.91,45.72 58.42,45.21 v58.42,43.18
  Bottom 0.61: v16.76,68.07 v20.32,68.07 21.34,67.06 21.34,61.98 22.15,61.16 23.16,61.16 24.37,59.94 24.38,59.94 25.2,59.13 25.2,55.88 25.7,55.37 38.8,55.37 40.97,53.2 40.97,47.75 41.42,47.3 43.64,47.3 44.2,46.74 44.2,43.99 44.7,43.48 47.75,43.48 48.26,43.99 48.26,45.65 C34.1 49.28,45.72 49.78,45.21 v50.8,45.21 | v29.97,24.84 29.97,32.51 | 29.97,32.51 v28.96,33.53 28.19,33.53 26.16,31.5 v18.29,31.5 | v58.42,43.18 57.71,43.18 52.22,37.69 39.22,37.69 38.61,37.08 38.61,34.04 38.1,33.53 35.56,33.53 35.2,33.88 35.2,35.56 34.67,36.09 33.4,36.09 32.87,35.56 32.87,33.88 32.51,33.53 30.99,33.53 29.97,32.51
  other vias: 28.45,16.76
  pour Top (no thermals): 25.91,24.89 29.97,24.89 29.97,15.75 25.91,15.75
+3V3INT  (via drill 0.41)
  Top 0.61: v50.8,49.78 U$9.6 U$9.5 58.93,49.78 v59.94,48.77 | Q1.3 46.14,63.58 v45.72,64.01 | J3.2 J4.2 10.66,50.3 11.68,49.28 12.7,49.28 | R9.2 R10.2 14.73,50.73 14.73,49.78 14.22,49.28 12.7,49.28 | v23.37,45.72 23.75,45.34 IC1.2 28.83,45.34 30.04,44.13 C28.1 v28.45,35.56 | J8.2 6.09,31.5 v6.1,31.5 | v3.56,36.58 5.08,36.58 5.97,37.47 16.13,37.47 17.27,38.61 v17.27,41.25 | v12.7,47.75 12.7,49.28
  Bottom 0.61: C14.1 9.72,50.73 10.67,49.78 11.68,49.78 12.62,48.84 12.62,47.68 | v45.72,64.01 47.75,64.01 48.77,62.99 48.77,57.4 52.15,54.03 52.15,50.11 51.82,49.78 v50.8,49.78 | v23.37,45.72 23.37,41.66 22.86,41.15 17.37,41.15 | v59.94,48.77 59.08,48.77 58.57,48.26 58.57,45.12 51.91,38.46 32.36,38.46 30.99,37.08 30.99,36.07 30.48,35.56 v28.45,35.56 | 17.37,41.15 13.21,41.15 12.62,41.73 J13.4 12.62,47.68 | 17.37,41.15 v17.27,41.25 | v12.7,47.75 12.62,47.68 | v6.1,31.5 4.57,31.5 3.56,32.51 v3.56,36.58
+5V  (via drill 0.41)
  Top 0.61: U$9.3 U$9.4 51.05,48.51 v50.8,48.26 46.74,48.26 46.23,47.75 46.23,36.58 45.21,35.56 v40.13,35.56 | J7.8 6.92,59.12 v7.11,58.93 | v40.13,33.53 40.07,33.46 R32.2 C12.1 v36.58,35.05 | L2.2 41.15,23.57 v41.15,24.89
  Bottom 0.61: v7.11,58.93 3.56,58.93 2.54,57.91 2.54,42.67 6.49,38.72 8.97,38.72 9.34,38.35 16.75,38.35 17.36,37.74 17.36,33.56 18.41,32.51 25.78,32.51 27.81,34.54 31.62,34.54 32,34.92 32,36.32 32.63,36.95 35.95,36.95 36.58,36.32 v36.58,35.05 | v50.8,48.26 49.78,48.26 49.28,47.75 C11.1 | v40.13,35.56 v40.13,33.53 40.13,28.96 40.62,28.47 43.18,28.47 43.84,27.81 43.84,27.05 43.18,26.39 41.63,26.39 41.15,25.91 v41.15,24.89
  pour Top (no thermals): 37.08,24.89 41.15,24.89 41.15,15.75 37.08,15.75
+12V  (via drill 0.41)
  Top 1.016: v6.6,15.75 9.14,15.75 10.16,16.76 JP1.1 9.94,20.29 U$6.1 | R29.1 v51.31,75.18 | v59.94,47.24 U$9.1 U$9.2 52,47.24 51.49,46.74 v50.8,46.74
  Bottom 1.016: v6.6,15.75 8.38,17.53 20.57,17.53 21.59,18.54 21.59,21.59 23.22,23.22 25.78,23.22 26.42,23.85 | v26.42,25.91 26.42,23.85 | 26.42,23.85 27.05,23.22 36.93,23.22 37.59,23.88 | v37.59,25.91 37.59,23.88 | 37.59,23.88 38.25,23.22 55.73,23.22 56.9,24.38 56.9,39.61 59.94,42.66 v59.94,47.24 | v50.8,46.74 52.51,46.74 53.24,47.47 53.24,54.55 49.99,57.8 49.99,63.65 49.23,64.41 49.23,74.17 50.24,75.18 v51.31,75.18
  pour Top (no thermals): 25.91,28.96 25.91,25.4 28.96,25.4 28.96,28.96
  pour Top (no thermals): 37.08,28.45 37.08,25.4 40.13,25.4 40.13,28.45
+12VINT  (via drill 0.41)
  Top 1.016: D1.1 18.66,3.18 17.78,4.06 13.72,4.06 12.7,5.08 v12.7,23.37 10.92,23.37 JP1.2 9.84,22.29 U$6.2
  Bottom 1.016: U$4.2 12.74,29.46 12.74,27.43 U$4.5 12.74,23.41 v12.7,23.37
GND  (via drill 0.41)
  Top 0.279: 36.07,30.45 36.77,29.75 IC2.4 | IC3.4 25.6,29.75 24.89,30.45
  Top 0.61: U$9.26 55.37,62.48 | 55.37,62.48 U$9.25 v59.94,62.48 | U$9.23 55.37,61.21 | 55.37,61.21 U$9.24 | 55.37,61.21 55.37,62.48 | 30.89,68.35 U1.41_9 U1.41_8 | 30.89,68.35 29.97,69.27 U1.1 20.65,69.27 20.32,69.6 20.32,75.69 19.81,76.2 18.59,76.2 S1.2 17.98,76.2 17.27,76.2 16.76,75.69 16.76,72.58 16.26,72.07 C1.2 14.73,72.64 14.1,73.28 7.75,73.28 7.11,72.64 7.11,71.25 6.28,70.42 | 47.24,75.18 C2.2 R30.2 | 47.24,75.18 46.15,76.28 44.07,76.28 S2.2 43.31,76.28 42.29,76.28 41.4,75.39 41.4,69.85 40.82,69.27 U1.40 31.8,69.27 30.89,68.35 | 47.24,75.18 48.26,76.2 52.83,76.2 53.34,75.69 C3.2 v54.86,73.59 | C21.2 C29.2 11.24,66.11 10.67,65.53 v9.14,65.53 C30.- 7.6,67.59 7.11,68.07 7.11,69.6 6.28,70.42 | 6.28,70.42 J7.S2 2.56,60.96 3.14,60.38 | J3.S2 1.79,53.97 1.79,53.98 1.79,55.69 2.56,56.45 J7.S1 2.56,59.79 3.14,60.38 | J3.S2 1.79,49.28 | 1.79,49.28 1.81,49.3 J3.1 J4.1 | J3.S2 J4.S2 10.03,53.6 11.46,55.02 BT1.- | J10.S2 J5.S2 | J10.S1 v5.08,41.89 J5.S1 | J5.S1 1.79,43.18 | 1.79,43.18 J5.S2 | 1.79,43.18 J5.1 J10.1 | J5.S1 1.25,41.89 0.51,41.15 0.51,35.58 1.28,34.8 J8.S2 1.79,30.48 | 1.79,30.48 J8.S1 | U$6.4 3.11,26.36 1.79,27.67 J8.S1 | U$6.4 5.89,24.69 v6.6,25.4 17.27,25.4 18.29,26.42 v18.29,27.94 | U$6.4 1.83,24.69 1.02,23.88 1.02,18.8 1.93,17.89 U$6.3 1.63,17.89 1.02,17.27 1.02,15.24 2.24,14.02 U$5.4 1.83,14.02 1.02,13.21 1.02,9.65 | 1.02,9.65 1.05,9.62 U$5.1 5.46,9.72 C8.2 | v23.37,35.05 R35.1 22.29,33.46 21.84,33.02 21.84,30.99 22.38,30.45 24.89,30.45 | IC1.13 33.15,42.8 31.94,41.59 C28.2 34.04,35.56 v34.04,35.05 34.04,33.97 R33.1 32.95,33.46 32.51,33.02 32.51,30.99 | 1.79,30.48 1.81,30.5 J8.1 7.11,30.5
  Top 0.61: 7.11,30.5 8.66,30.5 | 8.66,30.5 J9.1 | J9.S1 J8.S1 | J9.S2 7.89,31.28 | 7.89,31.28 7.11,30.5 | 8.66,30.5 7.89,31.28 | C37.2 v42.67,27.43 55.37,27.43 58.42,24.38 v58.42,10.16 58.42,6.1 53.34,1.02 J1.SH2 | J1.SH1 21.84,1.02 21.34,1.52 v21.34,7.62 21.34,8.64 21.84,9.14 R2.1 | IC3.8 24.55,26.07 v24.38,25.91 | IC2.8 35.73,26.07 v35.56,25.91 | 1.02,9.65 1.02,7.62 1.42,7.22 U$5.3 4.97,7.22 5.59,6.6 v5.59,5.59 5.59,3.56 7.11,2.03 v12.19,2.03 v16.76,2.03 | J7.7 3.14,60.38 | J1.A1/B12 26.82,5.99 26.09,5.26 J1.SH3 J1.SH1 | J1.SH1 J1.SH2 | J1.SH2 J1.SH4 35.88,5.26 35.16,5.99 J1.B1/A12 34.19,7.26 34.99,8.06 R3.1 | U1.41_8 U1.41_7 | U1.41_8 U1.41_1 | U1.41_1 U1.41_2 | U1.41_1 U1.41_3 | U1.41_1 U1.41_5 | U1.41_5 U1.41_4 | U1.41_5 U1.41_6 | C35.2 24.45,15.68 24.89,15.24 30.48,15.24 | 30.48,15.24 31.5,15.24 | 31.5,15.24 35.05,15.24 35.63,15.81 C10.2 35.63,16.19 36.58,15.24 40.64,15.24 41.66,14.22 41.66,5.59 42.16,5.08 v50.29,5.08 | 30.99,15.75 30.99,26.35 C13.2 29.91,29.91 30.48,30.48 32,30.48 32.51,30.99 | 30.99,15.75 30.48,15.24 | 31.5,15.24 30.99,15.75 | J4.S1 J3.S1 | J3.S1 J5.S2 | J3.S1 1.79,49.28 | 32.51,30.99 33.05,30.45 36.07,30.45
  Bottom 0.61: C34.2 C11.2 46.29,54.29 44.7,55.88 44.7,65.53 45.21,66.04 47.75,66.04 48.26,66.55 48.26,75.18 49.28,76.2 53.34,76.2 54.86,74.68 v54.86,73.59 54.29,73.59 53.76,73.06 J6.3 | J6.1 51.82,63.31 51.82,66.04 53.44,67.67 J6.3 | v23.37,35.05 22.66,35.76 22.66,37.59 21.13,39.12 19.3,39.12 9.65,39.12 8.13,40.64 6.33,40.64 v5.08,41.89 4.06,42.9 C14.2 9.59,48.83 10.43,47.99 J13.6 | v5.59,5.59 7.05,5.59 C17.2 7.11,6.6 7.62,7.11 | 7.62,7.11 10.24,7.11 10.79,7.67 J11.C5 10.79,9.78 11.18,10.16 11.18,15.24 11.68,15.75 18.29,15.75 18.85,15.19 J11.S2 18.85,10.11 v21.34,7.62 C7.2 | v59.94,62.48 59.94,67.06 59.33,67.67 J6.3 | v58.42,10.16 56.36,10.16 | 56.36,10.16 J2.S1 | v34.04,35.05 34.04,28.45 35.56,26.92 v35.56,25.91 35.56,26.67 36.32,27.43 v42.67,27.43 | 7.62,7.11 6.55,8.18 J11.S1 6.55,14.44 5.64,15.35 5.64,16.15 6.55,17.06 J11.S4 | v6.6,25.4 2.03,25.4 0.51,26.92 0.51,40.64 1.65,41.78 1.65,64.01 3.17,65.53 v9.14,65.53 9.65,65.53 10.16,66.04 10.16,69.02 11.18,70.04 20,70.04 22.37,67.67 J6.4 27.43,65.54 27.43,63.49 J6.2 | J2.50 30.66,12.52 30.99,12.19 33.53,12.19 | J2.34 37.06,12.67 36.58,12.19 | 40.26,12.32 J2.26 | J2.18 43.46,12.47 43.18,12.19 | J2.4 52.26,12.63 | 52.26,12.63 51.82,12.19 50.29,12.19 50.26,12.16 | J2.9 50.26,12.16 | 47.75,12.19 47.86,12.09 J2.15 47.86,7.72 45.82,5.69 C20.- 46.74,4.06 47.69,5.01 C24.2 50.23,5.01 v50.29,5.08 | 50.26,12.16 50.22,12.19 47.75,12.19 | 47.75,12.19 43.18,12.19 | J2.21 42.26,11.78 | 42.26,11.78 42.67,12.19 43.18,12.19 | J2.27 39.86,11.92 | 39.86,11.92 40.26,12.32 | 40.26,12.32 40.38,12.19 41.84,12.19 42.26,11.78 | 36.58,12.19 39.12,12.19
  Bottom 0.61: 39.12,12.19 39.58,12.19 39.86,11.92 | 36.58,12.19 36.07,12.19 | 36.07,12.19 33.53,12.19 | J2.37 35.86,11.98 36.07,12.19 | J2.35 36.66,12.11 36.58,12.19 | J2.43 33.46,12.12 33.53,12.19 | J2.29 39.06,12.13 39.12,12.19 | 56.36,10.16 56.39,10.19 56.39,11.68 55.88,12.19 52.7,12.19 | 52.7,12.19 52.26,12.63 | J2.S2 27.01,11.77 27.43,12.19 52.7,12.19 | C18.2 v12.19,2.03 | C19.2 v16.76,2.03 | J11.S3 18.85,25.4 | 18.85,25.4 18.85,27.38 v18.29,27.94 | v24.38,25.91 19.36,25.91 18.85,25.4
  pour Top (isolate 0.254, rank 2): -0.51,77.72 -0.51,-0.51 62.48,-0.51 62.48,77.72
  pour Bottom (isolate 0.254, rank 2): -1.02,78.23 62.99,78.23 62.99,-1.02 -1.02,-1.02
IO0  (via drill 0.41)
  Top 0.406: U1.27 39.81,52.83 v42.67,52.83 | S2.1 44.45,70.16 52.63,70.16 53.34,70.87 C3.1
  Top 0.61: v43.69,70.61 S2.1
  Bottom 0.406: v42.67,52.83 42.67,53.37 39.75,56.29 39.75,62.76 42.52,65.53 42.52,69.44 v43.69,70.61
IO1
  Top 0.406: U1.39 41.33,68 42.49,69.16 42.49,70.1 42.49,70.94 43.25,71.69 C2.1 R30.1 R29.2
IO2  (via drill 0.41)
  Top 0.279: IC2.2 39.01,28.85 39.12,28.96 39.62,28.96
  Top 0.406: U1.38 41.48,66.73 v41.66,66.55 | 39.62,28.96 41.66,28.96 42.67,29.97 42.67,33.53 41.66,34.54 39.62,34.54 39.12,35.05 39.12,36.58 40.64,38.1 40.64,47.24 41.15,47.75 42.67,47.75 v43.18,48.26
  Bottom 0.406: v41.66,66.55 39.14,64.03 39.14,57.91 | 39.14,57.91 | v43.18,48.26 42.57,48.26 41.68,49.15 41.68,53.5 39.14,56.04 39.14,57.91
IO4
  Top 0.305: 5.59,64.12 J7.4
  Top 0.406: U1.4 16.18,65.46 14.85,64.12 5.59,64.12
IO5
  Top 0.406: J7.5 8.64,62.88 15.12,62.88 16.44,64.19 U1.5
IO6
  Top 0.406: U1.6 18.21,62.92 16.92,61.62 16.92,45.74 16.32,45.15 9.21,45.15 8.25,44.19 J5.2
IO7
  Top 0.406: U1.7 18.47,61.65 17.53,60.71 17.53,45.34 16.38,44.19 J10.2
IO8  (via drill 0.41)
  Top 0.305: U$9.21 59.44,59.94 v59.94,60.45
  Top 0.406: U1.12 20.39,55.3 v20.32,55.37 | J3.4 J4.4 10.64,52.3 v11.18,52.83 R9.1 | IC1.15 32.38,45.34 30.23,47.5 24.89,47.5 23.88,48.51 v23.88,49.28
  Bottom 0.406: v59.94,60.45 58.93,60.45 54.25,55.78 54.25,46.48 50.55,42.77 41.39,42.77 39.03,45.13 39.03,52.41 38,53.44 24.44,53.44 | v11.18,52.83 16.26,52.83 18.8,55.37 v20.32,55.37 22.48,55.37 24.41,53.44 24.44,53.44 | v23.88,49.28 23.88,52.88 24.44,53.44
IO9  (via drill 0.41)
  Top 0.305: v11.18,51.31 9.4,51.31 J4.3 | U$9.19 59.69,58.67 v59.94,58.93
  Top 0.406: U1.17 26.54,50.42 v25.4,49.28 25.4,48.77 26.06,48.11 30.89,48.11 32.38,46.61 IC1.16 | J3.3 J4.3 | R10.1 11.68,50.8 v11.18,51.31
  Bottom 0.406: v59.94,58.93 58.27,58.93 54.86,55.53 54.86,46.3 50.73,42.16 41.14,42.16 38.41,44.9 38.41,51.71 37.28,52.83 26.92,52.83 25.4,51.31 v25.4,49.28 25.4,48.77 24.89,48.26 22.35,48.26 19.3,51.31 v11.18,51.31
IO10  (via drill 0.41)
  Top 0.406: U1.18 27.81,50.16 v26.92,49.28
  Bottom 0.406: v26.92,49.28 26.92,48.16 26.42,47.65 22.86,47.65 15.75,47.65 14.82,46.73 J13.2
IO11  (via drill 0.41)
  Top 0.305: U$9.17 v59.94,57.4
  Top 0.406: U1.19 29.08,49.91 v28.45,49.28
  Bottom 0.406: v59.94,57.4 57.6,57.4 55.47,55.27 55.47,46.12 50.91,41.55 40.76,41.55 37.8,44.52 37.8,51.1 36.78,52.12 29.26,52.12 28.45,51.31 v28.45,49.28 28.45,47.75 27.74,47.04 17.7,47.04 16.89,46.23 16.89,42.55 16.26,41.91 14.22,41.91 13.72,42.41 J13.3
IO12  (via drill 0.41)
  Top 0.305: U$9.15 59.69,56.13 v59.94,55.88
  Top 0.406: U1.20 30.35,49.66 v29.97,49.28
  Bottom 0.406: v59.94,55.88 57.4,55.88 56.08,54.56 56.08,45.94 51.09,40.95 40.38,40.95 37.19,44.14 37.19,50.44 36.11,51.51 30.81,51.51 29.97,50.67 v29.97,49.28 29.97,47.75 28.65,46.43 25.09,46.43 24.38,45.72 24.38,40.99 23.83,40.44 12.27,40.44 11.53,41.18 J13.5
IO13  (via drill 0.41)
  Top 0.406: v32,49.28 31.62,49.66 U1.21 | U$9.13 59.44,54.86 v59.94,54.36
  Bottom 0.406: v59.94,54.36 58.32,54.36 56.69,52.73 56.69,45.76 51.27,40.34 40.13,40.34 36.58,43.89 36.58,49.89 35.56,50.9 32.74,50.9 32,50.16 v32,49.28 32,46.74 31.09,45.82 26.11,45.82 24.99,44.7 24.99,40.74 24.08,39.83 10.16,39.83 9.32,40.66 J13.7
IO14  (via drill 0.41)
  Top 0.305: U$9.11 59.18,53.59 v59.94,52.83 | 32.89,51.31 U1.22
  Top 0.406: v33.53,49.28 32.89,49.91 32.89,51.31 | v20.83,35.05 18.27,32.5 J9.3
  Bottom 0.406: v59.94,52.83 58.42,52.83 57.3,51.71 57.3,45.58 51.45,39.73 39.88,39.73 35.92,43.69 35.92,49.63 35.33,50.22 33.96,50.22 33.53,49.78 v33.53,49.28 33.53,46.23 32.56,45.26 26.98,45.26 25.55,43.84 25.55,40.51 24.38,39.34 24.38,34.92 23.7,34.24 22.66,34.24 21.84,35.05 v20.83,35.05
IO15  (via drill 0.41)
  Top 0.406: v20.32,60.45 22.16,60.45 U1.8 | v44.2,7.11 v44.2,24.89 | v43.18,36.58 v43.18,45.72
  Bottom 0.305: J2.17 43.86,7.45 v44.2,7.11
  Bottom 0.406: v43.18,45.72 43.18,46.23 42.82,46.58 40.91,46.58 40.26,47.24 40.26,52.91 38.5,54.66 25.09,54.66 24.49,55.27 24.49,58.83 22.86,60.45 v20.32,60.45 | v44.2,24.89 44.2,25.68 45.06,26.55 45.06,28.38 43.18,30.25 v43.18,36.58
IO16  (via drill 0.41)
  Top 0.406: v20.32,58.93 20.5,59.11 U1.9 | v42.67,7.11 v42.67,24.89 | v41.66,45.72 v41.66,36.58
  Bottom 0.305: J2.19 43.06,7.5 v42.67,7.11
  Bottom 0.406: v41.66,45.72 40.83,45.72 39.65,46.91 39.65,52.66 38.25,54.05 24.69,54.05 23.88,54.86 23.88,57.4 22.35,58.93 v20.32,58.93 | v42.67,24.89 42.67,25.35 43.05,25.73 43.45,25.73 44.5,26.78 44.5,28.14 41.66,30.99 v41.66,36.58
IO17
  Top 0.406: U1.10 19.23,57.84 18.14,56.74 18.14,38.18 16.64,36.68 6.35,36.68 5.49,35.81 5.49,33.81 5.18,33.5 J8.4
IO18
  Top 0.406: J8.3 5.58,32.5 6.1,33.02 6.1,35.56 6.6,36.07 17.27,36.07 18.75,37.54 18.75,55.83 19.48,56.57 U1.11
IO19
  Top 0.305: U1.13 20.5,54.03 19.3,52.83 19.3,38.47 21.84,35.93 21.84,34.53 19.3,31.99 19.3,11.54 20.18,10.67 29.97,10.67 | J1.B7 30.24,10.4 29.97,10.67 | J1.A7 31.24,10.16 30.73,10.67 29.97,10.67
IO20
  Top 0.305: U1.14 20.75,52.76 19.81,51.82 19.81,38.61 22.35,36.07 22.35,34.39 19.81,31.85 19.81,11.68 20.32,11.18 30.99,11.18 31.74,10.43 J1.B6 31.74,4.31 31.5,4.06 30.99,4.06 30.74,4.31 J1.A6 30.74,8.76
IO21  (via drill 0.41)
  Top 0.305: U$9.9 58.93,52.32 v59.94,51.31
  Top 0.406: U1.23 34.16,50.16 34.54,49.78 v35.05,49.28
  Bottom 0.406: v59.94,51.31 58.93,51.31 57.91,50.29 57.91,45.4 51.63,39.12 39.62,39.12 35.05,43.69 35.05,47.75 v35.05,49.28
IO35
  Top 0.305: 40.13,54.03 U1.28
  Top 0.406: U$9.12 43.13,53.59 42.7,54.03 40.13,54.03
IO36
  Top 0.406: U$9.14 43.18,54.86 42.75,55.3 U1.29
IO37
  Top 0.406: U1.30 42.67,56.57 43.11,56.13 U$9.16
IO38
  Top 0.406: U$9.18 43.18,57.4 42.75,57.84 U1.31
IO39
  Top 0.406: U$9.20 43.18,58.67 42.75,59.11 U1.32
IO40
  Top 0.406: U1.33 42.87,60.38 43.81,59.44 50.8,59.44 51.33,59.97 53.31,59.97 U$9.22
IO41
  Top 0.406: U1.34 41.84,61.65 43.62,63.43 R4.1
IO42
  Top 0.406: U1.35 42.09,62.92 42.67,63.5 42.67,67.06 43.18,67.56 44.13,67.56 R6.1
IO47
  Top 0.406: U1.24 35.43,50.42 36.68,49.17 40.26,49.17 42.39,51.31 44.7,51.31 44.96,51.05 U$9.8
IO48
  Top 0.406: U1.25 36.7,50.67 37.59,49.78 40.01,49.78 42.16,51.94 44.83,51.94 45.21,52.32 U$9.10
N$1
  Top 0.305: J1.A5 29.74,8.3 R2.2
N$2  (via drill 0.41)
  Top 0.61: BT1.+ 15.08,75.02 v15.24,75.18 | IC1.14 38.99,44.07 39.93,45.01 39.93,47.84 42.38,50.29 v43.18,50.29
  Bottom 0.61: v43.18,50.29 43.38,50.29 44.15,51.05 44.15,54.28 43.18,55.25 43.18,66.16 44.58,67.56 45.72,67.56 46.23,68.07 46.23,74.68 45.21,75.69 42.67,75.69 41.66,74.68 41.66,70.87 40.64,69.85 21.59,69.85 19.3,72.14 19.3,74.17 18.29,75.18 v15.24,75.18
N$3
  Top 0.61: U$2.2 22.86,2.67 D1.2
N$4
  Top 0.406: R4.2 46.24,61.53 Q1.1 46.29,60.77 46.74,60.33 49.91,60.33 50.29,60.71 R5.1
N$5
  Top 0.305: J1.B5 32.74,8.8 R3.2
N$7
  Top 0.406: R6.2 46.24,65.6 Q2.1 47.33,64.52 49.78,64.52 50.29,65.02 R7.1
N$10
  Top 0.279: C9.1 33.97,28.89 34.38,29.3 IC2.6
N$26
  Top 0.305: C9.2 32.07,23.5 L2.1
  Top 0.406: IC2.9 36.58,22.66 35.76,21.84 L2.1
N$31
  Top 0.279: IC2.3 38.44,29.3 38.61,29.46 R32.1
  Top 0.305: R32.1 C12.2 R33.2
N$33
  Top 0.279: IC3.6 23.2,29.3 22.79,28.89 C33.1
N$34
  Top 0.305: IC3.9 25.4,23.37 23.88,21.84 L5.1 20.89,23.5 C33.2
N$35
  Top 0.279: R34.1 27.43,29.46 27.27,29.3 IC3.3
  Top 0.406: R35.2 C36.2 R34.1
SC_CLK
  Bottom 0.406: J11.C3 14.61,7.62 14.22,7.24 R13.1
SC_DATA
  Bottom 0.406: R12.1 18.8,6.6 18.29,7.11 16.26,7.11 15.88,7.49 J11.C7
SC_RST
  Bottom 0.305: 9.18,5.55 R14.1
  Bottom 0.406: 9.18,5.55 10,5.55 12.06,7.62 J11.C2
SIM_CLK
  Bottom 0.406: C18.1 14.09,3.62 R13.2 14.22,1.72 14.72,1.22 22.33,1.22 23.81,2.7 23.81,19.72 24.97,20.88 48.21,20.88 49.06,20.03 J2.12
SIM_DATA
  Bottom 0.406: C19.1 16.89,5.52 R12.2 18.8,2.16 19.18,1.78 22.1,1.78 23.25,2.93 23.25,20.08 24.61,21.44 48.67,21.44 49.86,20.25 J2.10
SIM_RST
  Bottom 0.305: R14.2 9.08,3.56
  Bottom 0.406: C17.1 9.01,3.62 9.08,3.56 | R14.2 9.14,1.65 10.13,0.66 22.56,0.66 24.37,2.47 24.37,19.29 25.4,20.32 47.75,20.32 48.26,19.82 J2.14
SIM_VDD
  Bottom 0.406: C7.1 22.04,3.62 22.7,4.28 22.7,15.91 22.07,16.54 | J11.C1 9.53,9.78 8.64,10.67 8.64,15.75 9.42,16.54 22.07,16.54 | 22.07,16.54 22.7,17.16 22.7,20.54 24.16,22 49.12,22 50.66,20.46 J2.8
VBAT  (via drill 0.41)
  Top 1.016: v4.06,15.75 4.7,15.75 6.25,14.2 9.3,14.2 10.16,13.34 C8.1 U$5.2
  Bottom 1.016: v4.06,15.75 4.06,22.73 5.12,23.79 9.56,23.79 10.24,24.46 U$4.6 U$4.3
VCC_USB
  Top 0.61: 33.39,7.48 J1.B4/A9 33.39,3.92 32.51,3.05 29.46,3.05 28.59,3.92 J1.A4/B9 28.59,7.1 28.07,7.62 23.37,7.62 22.86,7.11 U$2.1
VREG  (via drill 0.41)
  Top 0.61: Q2.3 v47.24,69.09 | v46.23,24.89 46.23,21.84 47.24,20.83 v52.83,20.83 54.36,20.83 55.88,19.3 55.88,5.59 53.34,3.05 v50.29,3.05 42.16,3.05 40.64,4.57 40.64,11.18 39.62,12.19 26.42,12.19 25.91,12.7 v25.91,13.72 | v44.7,36.58 v44.7,48.77
  Bottom 0.61: v44.7,48.77 44.96,49.02 44.96,54.55 43.94,55.56 43.94,65.85 44.9,66.8 46.74,66.8 47.24,67.31 v47.24,69.09 | v50.29,3.05 48.83,3.05 C24.1 48.77,1.52 48.26,1.02 40.13,1.02 39.52,1.63 C20.+ 39.52,6.2 38.1,7.62 35.31,7.62 34.54,8.38 34.54,9.62 | J2.41 34.54,9.62 | 34.54,9.62 J2.39 | J2.2 53.06,20.6 v52.83,20.83 | v25.91,13.72 25.91,18.8 26.42,19.3 29.46,19.3 29.86,18.91 J2.52 | v46.23,24.89 46.23,25.91 45.72,26.42 45.72,28.65 44.7,29.66 v44.7,36.58
(copper drawn outside any net)
  shapes: Top area x4

### Text on the board
tPlace: Rev. D
tNames: RESET | +5V | GND | 3.3V | GND | IN | BOOT | SWITCH / BYPASS | I2C | ON | OFF | 14 | 26 | 27